# Altium schematic sheet LED_7SEG.SchDoc
size A; SheetNumber: 3; SheetTotal: 9
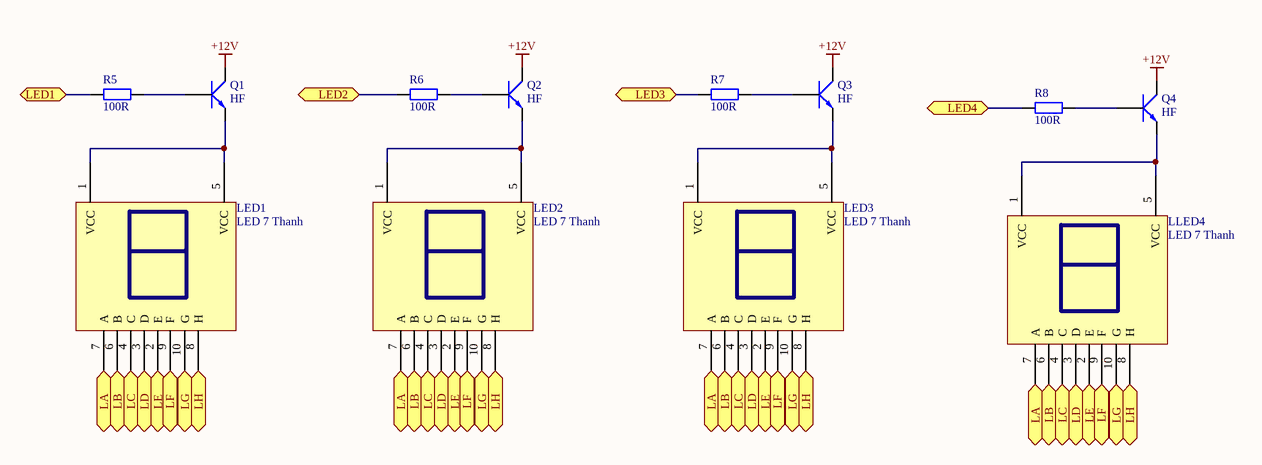
[diagram p0: LED_7SEG.SchDoc]

## Parts
LED1  LED 7 Thanh  [LED7SEG_2.3inch]
LED2  LED 7 Thanh  [LED7SEG_2.3inch]
LED3  LED 7 Thanh  [LED7SEG_2.3inch]
LLED4  LED 7 Thanh  [LED7SEG_2.3inch]
Q1  HF  [SOT23]
Q2  HF  [SOT23]
Q3  HF  [SOT23]
Q4  HF  [SOT23]
R5  100R  [tro smd 0603]
R6  100R  [tro smd 0603]
R7  100R  [tro smd 0603]
R8  100R  [tro smd 0603]

## Ports
LA (bidir), LB (bidir), LC (bidir), LD (bidir), LE (bidir), LED1 (bidir), LED2 (bidir), LED3 (bidir), LED4 (bidir), LF (bidir), LG (bidir), LH (bidir)

## Nets
+12V: Q1.3(C) Q2.3(C) Q3.3(C) Q4.3(C)
LA: LED1.7(A) LED2.7(A) LED3.7(A) LLED4.7(A) ; port LA
LB: LED1.6(B) LED2.6(B) LED3.6(B) LLED4.6(B) ; port LB
LC: LED1.4(C) LED2.4(C) LED3.4(C) LLED4.4(C) ; port LC
LD: LED1.3(D) LED2.3(D) LED3.3(D) LLED4.3(D) ; port LD
LE: LED1.2(E) LED2.2(E) LED3.2(E) LLED4.2(E) ; port LE
LED1: R5.1 ; port LED1
LED2: R6.1 ; port LED2
LED3: R7.1 ; port LED3
LED4: R8.1 ; port LED4
LF: LED1.9(F) LED2.9(F) LED3.9(F) LLED4.9(F) ; port LF
LG: LED1.10(G) LED2.10(G) LED3.10(G) LLED4.10(G) ; port LG
LH: LED1.8(H) LED2.8(H) LED3.8(H) LLED4.8(H) ; port LH
NetLED1_1: LED1.1(VCC) LED1.5(VCC) Q1.2(E)
NetLED2_1: LED2.1(VCC) LED2.5(VCC) Q2.2(E)
NetLED3_1: LED3.1(VCC) LED3.5(VCC) Q3.2(E)
NetLLED4_1: LLED4.1(VCC) LLED4.5(VCC) Q4.2(E)
NetQ1_1: Q1.1(B) R5.2
NetQ2_1: Q2.1(B) R6.2
NetQ3_1: Q3.1(B) R7.2
NetQ4_1: Q4.1(B) R8.2

## Library data of the parts
LED1-LED3 LLED4 = LED 7x1 2.3inch Anot: Dán; Don_Vi: Con; Ma_Hang: MH000901; Ten_Linh_Kien: Led 7 2.3 1 Số Anot (Sáng Đỏ); Ghi_Chu: *; Kieu_Chan: *; Chung_Loai: Dán
Q1-Q4 = C1815 HF SMD: NPN transistor; Value: C9014
R5-R8 = Tro 0603 5% 100R: Dán; Don_Vi: Con; So_Chan: 2; Ten_Linh_Kien: Trở 0603 5% 100R; Ma_Hang: MH006315; Chung_Loai: Dán; Kieu_Chan: *